# EAGLE design EAGLE (EAGLE 9.6.2)
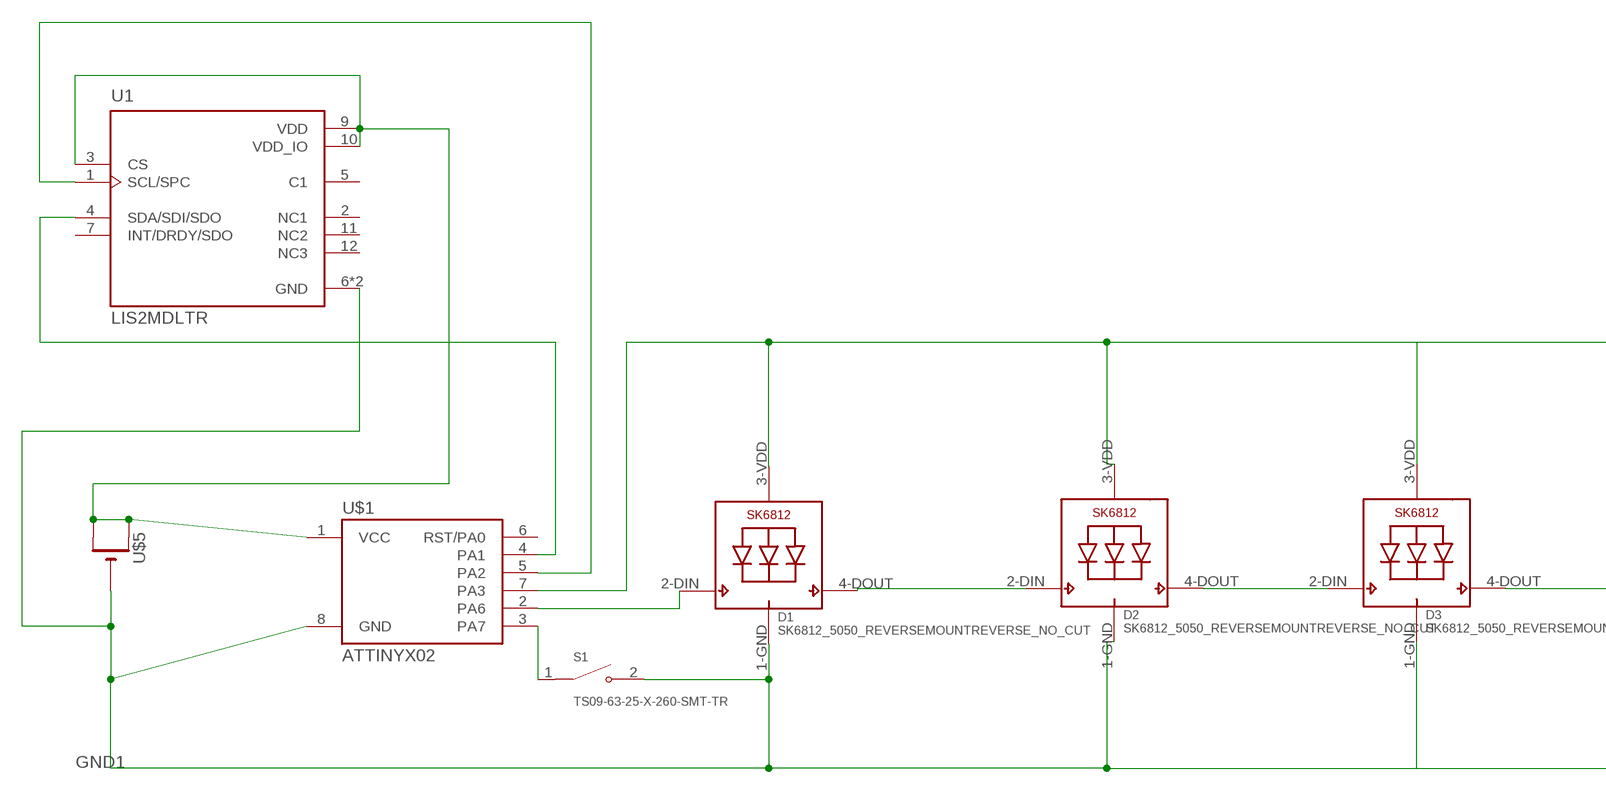
[diagram p0: schematic, sheet 1, part 1 of 2]
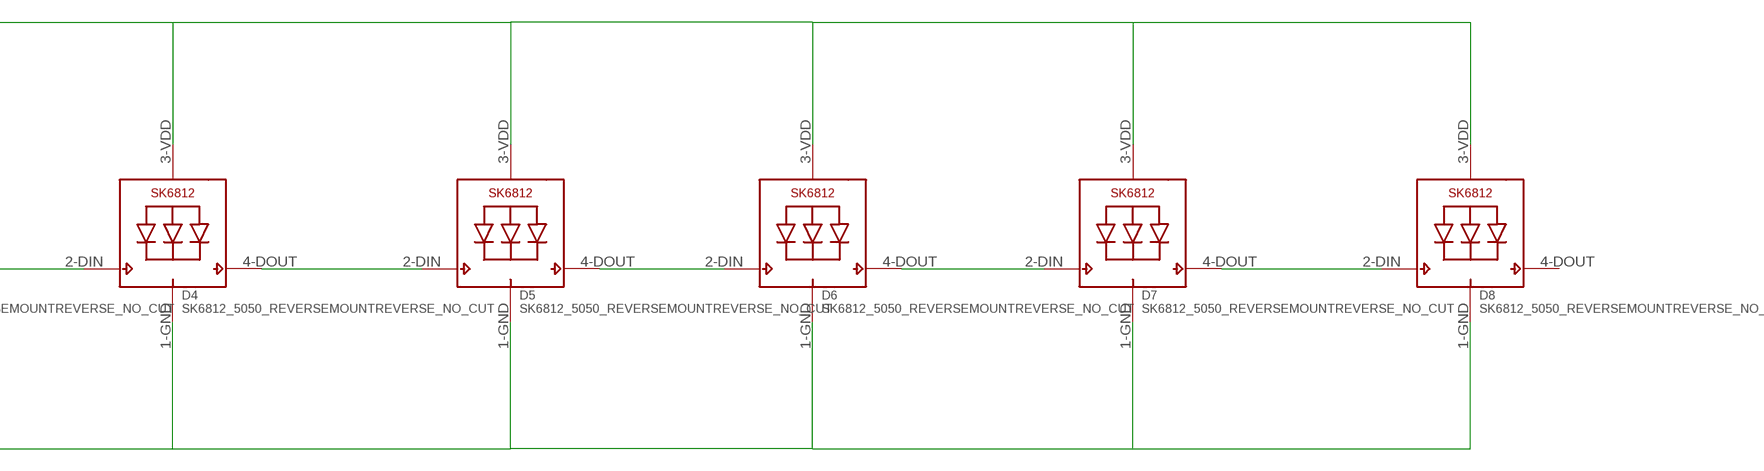
[diagram p1: schematic, sheet 1, part 2 of 2]

## Parts
D1  SK6812_5050_REVERSEMOUNTREVERSE_NO_CUT  [SK6812_REVERSE_NO_CUT]
D2  SK6812_5050_REVERSEMOUNTREVERSE_NO_CUT  [SK6812_REVERSE_NO_CUT]
D3  SK6812_5050_REVERSEMOUNTREVERSE_NO_CUT  [SK6812_REVERSE_NO_CUT]
D4  SK6812_5050_REVERSEMOUNTREVERSE_NO_CUT  [SK6812_REVERSE_NO_CUT]
D5  SK6812_5050_REVERSEMOUNTREVERSE_NO_CUT  [SK6812_REVERSE_NO_CUT]
D6  SK6812_5050_REVERSEMOUNTREVERSE_NO_CUT  [SK6812_REVERSE_NO_CUT]
D7  SK6812_5050_REVERSEMOUNTREVERSE_NO_CUT  [SK6812_REVERSE_NO_CUT]
D8  SK6812_5050_REVERSEMOUNTREVERSE_NO_CUT  [SK6812_REVERSE_NO_CUT]
S1  TS09-63-25-X-260-SMT-TR  [SW_TS09-63-25-X-260-SMT-TR]
U1  LIS2MDLTR  [PQFN50P200X200X70-12N]
U$1  ATTINYX02  [SOIC08_JEDEC_150MIL]
U$5  CR2032SMT  [CR2032-SMD]

## Nets
GND1: D1.1-GND(GND) D2.1-GND(GND) D3.1-GND(GND) D4.1-GND(GND) D5.1-GND(GND) D6.1-GND(GND) D7.1-GND(GND) D8.1-GND(GND) S1.2 U1.6(GND) U1.8(GND) U$1.8(GND) U$5.-
N$2: D1.4-DOUT(DO) D2.2-DIN(DI)
N$3: D1.2-DIN(DI) U$1.2(PA6)
N$5: D3.4-DOUT(DO) D4.2-DIN(DI)
N$6: D2.4-DOUT(DO) D3.2-DIN(DI)
N$7: S1.1 U$1.3(PA7)
N$8: D4.4-DOUT(DO) D5.2-DIN(DI)
N$88: D6.4-DOUT(DO) D7.2-DIN(DI)
N$89: D7.4-DOUT(DO) D8.2-DIN(DI)
N$90: D5.4-DOUT(DO) D6.2-DIN(DI)
N$91: U1.1(SCL/SPC) U$1.5(PA2)
N$92: U1.4(SDA/SDI/SDO) U$1.4(PA1)
VCC1: U1.3(CS) U1.9(VDD) U1.10(VDD_IO) U$1.1(VCC) U$5.+$1(+) U$5.+$2(+1)
VDD2: D1.3-VDD(VDD) D2.3-VDD(VDD) D3.3-VDD(VDD) D4.3-VDD(VDD) D5.3-VDD(VDD) D6.3-VDD(VDD) D7.3-VDD(VDD) D8.3-VDD(VDD) U$1.7(PA3)
Unconnected: D8.4-DOUT(DO) U1.2(NC1) U1.5(C1) U1.7(INT/DRDY/SDO) U1.11(NC2) U1.12(NC3) U$1.6(RST/PA0)

## Library data of the parts
D1-D8 = mylibrary:SK6812_5050_REVERSEMOUNT
S1 = mylibrary:TS09-63-25-X-260-SMT-TR; MANUFACTURER: CUI Devices; MAXIMUM_PACKAGE_HEIGHT: 2.5 mm; PARTREV: 1.0; STANDARD: Manufacturer Recommendations
U1 = 2025:LIS2MDLTR: Check availability; AVAILABILITY: In Stock; CHECK_PRICES: https://www.snapeda.com/parts/LIS2MDLTR/STMicroelectronics/view-part/?ref=eda; DESCRIPTION: Magnetoresistive Sensor X, Y, Z Axis 12-LGA (2x2); MF: STMicroelectronics; MP: LIS2MDLTR; PACKAGE: WFLGA-12 STMicroelectronics; PRICE: None; SNAPEDA_LINK: https://www.snapeda.com/parts/LIS2MDLTR/STMicroelectronics/view-part/?ref=snap
U$1 = mylibrary:ATTINYX02
U$5 = adafruit:CR2032

## Board
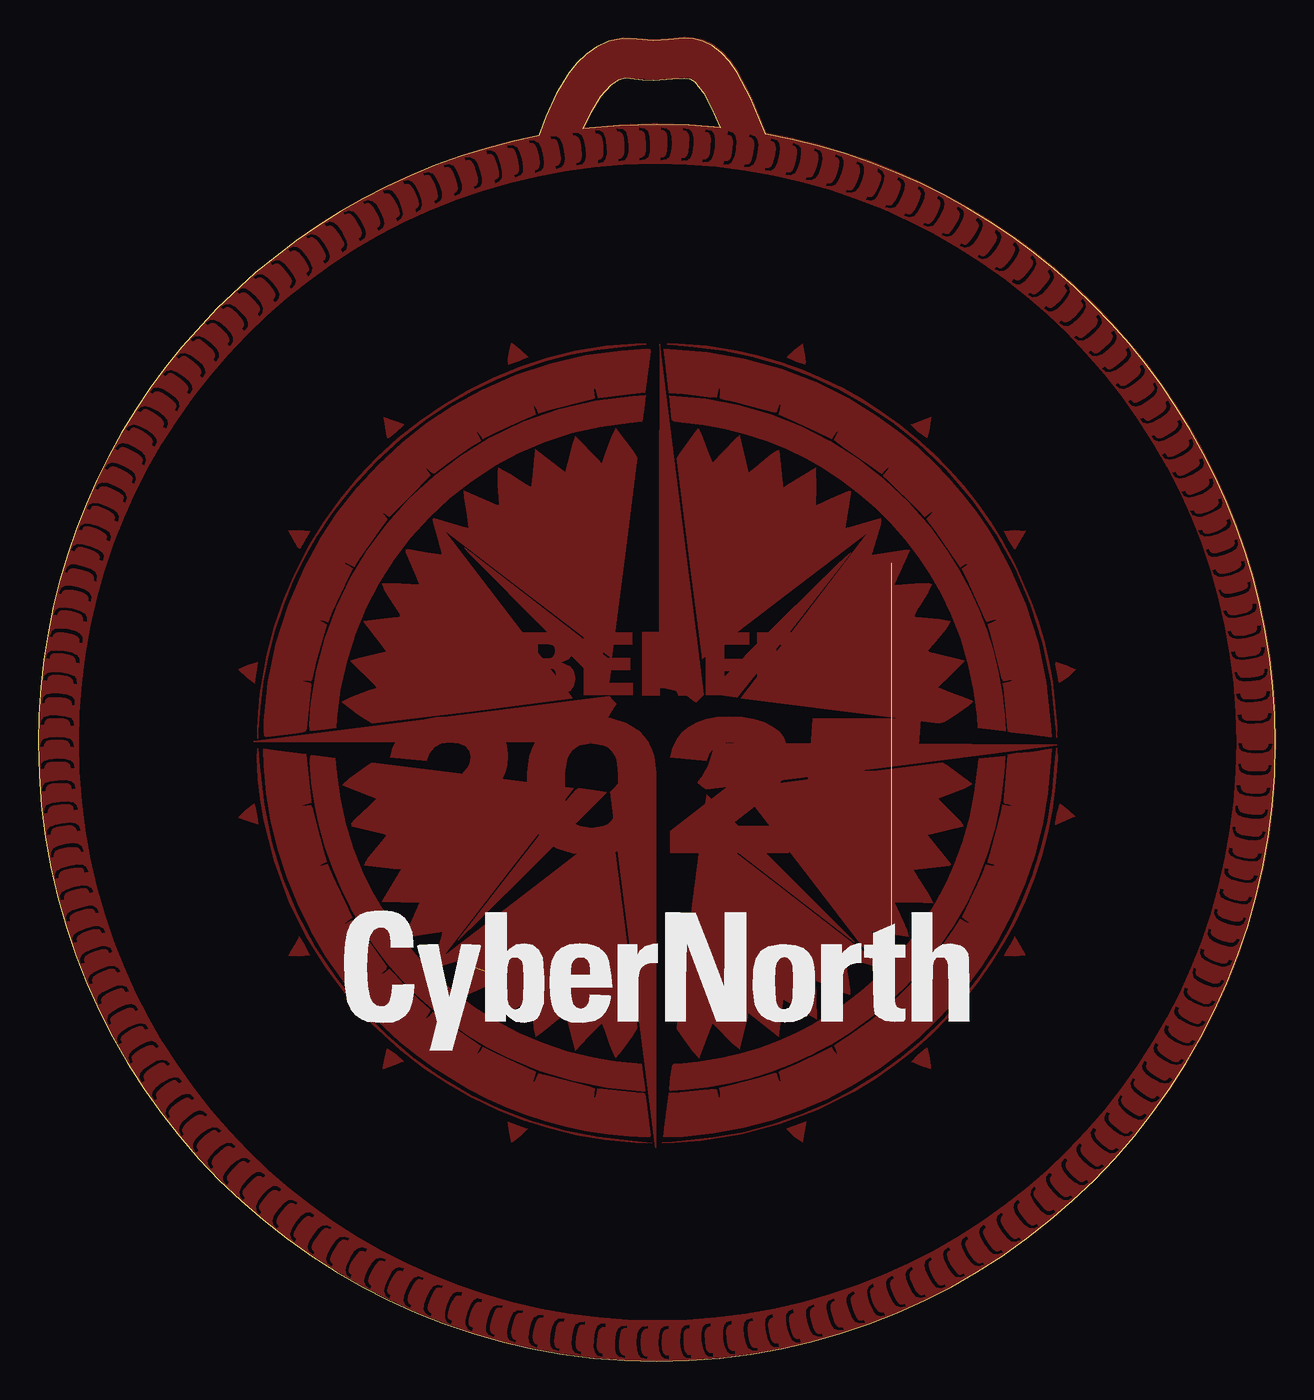
[diagram p2: board, top side]
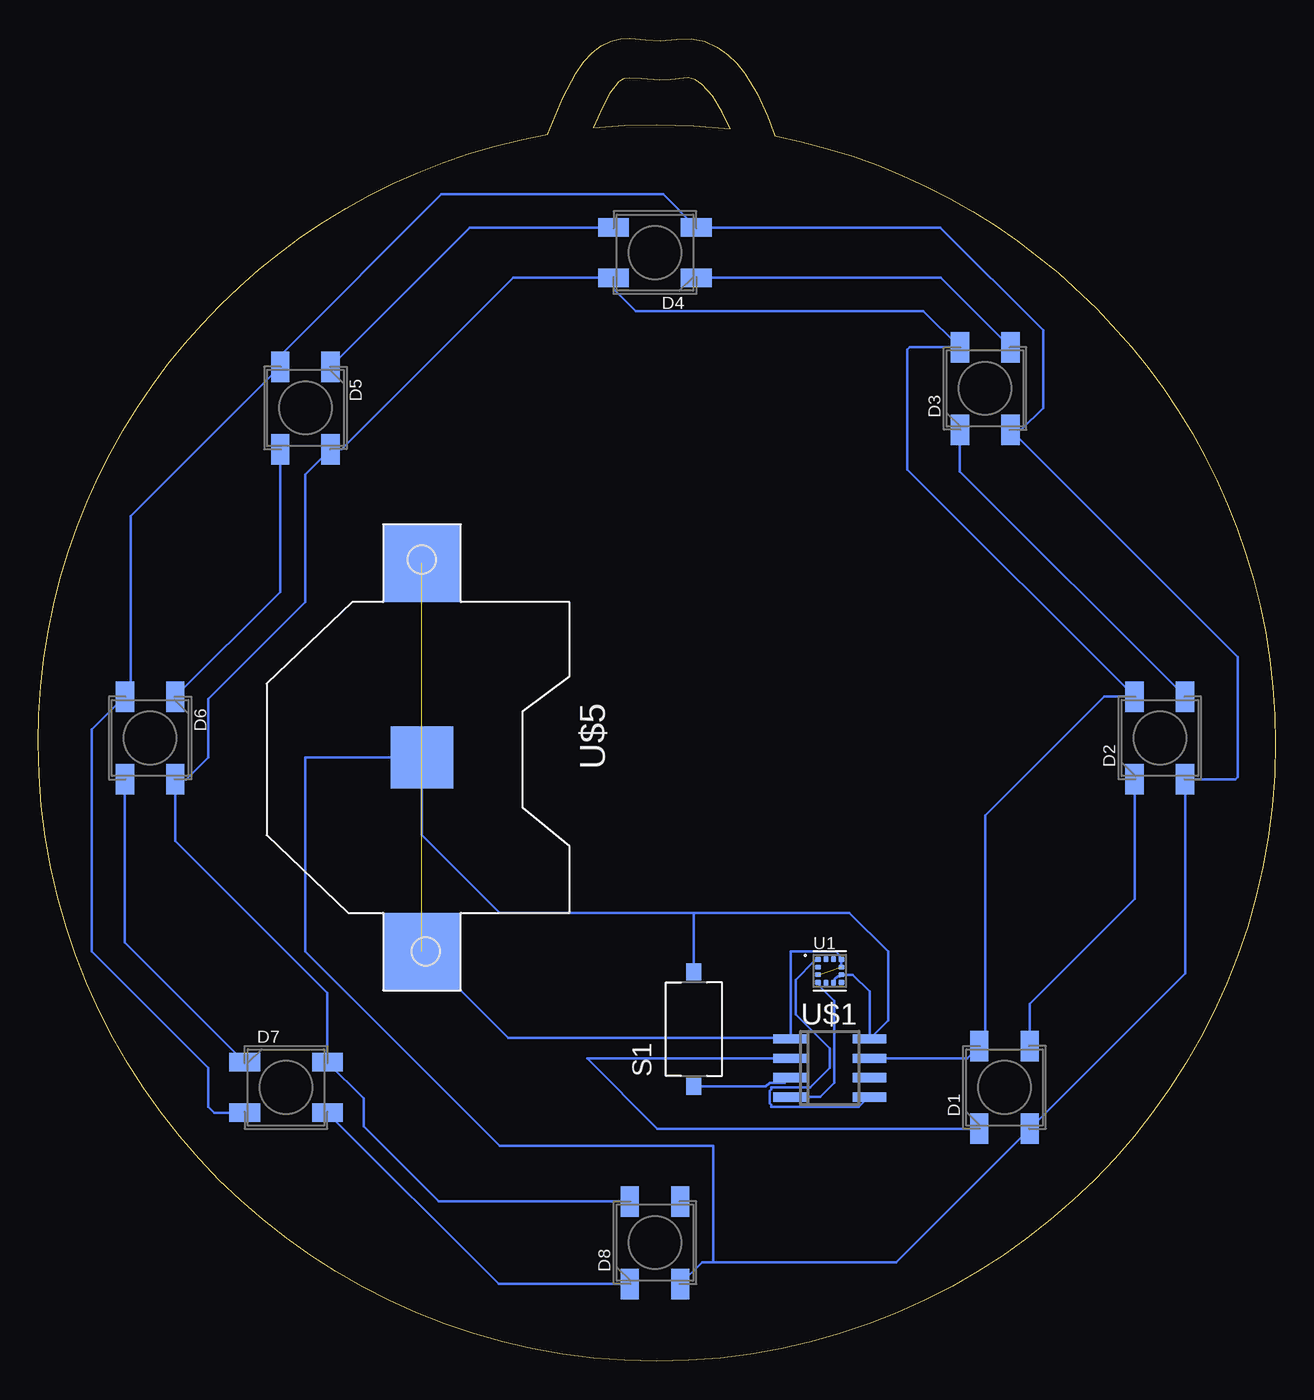
[diagram p3: board, bottom side, seen from below]

Size 80.91 x 86.56 mm. Coordinates in mm from the lower left corner, seen from the top.
Outline: 164 segments
Copper layers (1*16): Top 0.035mm / dielectric 1.5mm / Bottom 0.035mm
Design rules "default *": minimum track width 6mil, minimum drill 0.35mm, track to track 6mil, track to pad 6mil, pad to pad 6mil, via to via 6mil, smd to smd 6mil, copper to edge 0mil, drill to drill 6mil, minimum pad ring 10mil, minimum via ring 8mil, stop-mask expansion 4mil, vias tented up to drill 0mil, thermal gap 10mil
tRestrict: area 30.7,77.5 to 31.7,79.5; area 32.1,77.8 to 33,79.9; area 29.3,77.1 to 30.3,79.2; area 27.9,76.7 to 29,78.8; area 26.6,76.3 to 27.7,78.3; area 33.6,78 to 34.4,80.1; area 35,78.2 to 35.8,80.3; area 36.4,78.4 to 37.2,80.5; area 37.9,78.5 to 38.6,80.6; area 39.3,78.6 to 40,80.7; area 40.7,78.6 to 41.4,80.7; area 42.1,78.6 to 42.8,80.7; 162 more areas
bRestrict: area 5.8,39 to 9.3,42.6; area 17.2,61.8 to 20.8,65.4; area 38.8,70.7 to 42.4,74.3; area 61.6,60.6 to 65.2,64.2; area 71.8,39 to 75.4,42.6; area 62.9,16.1 to 66.5,19.7; area 38.8,6 to 42.4,9.6; area 15.9,16.1 to 19.5,19.7

### Footprints (pad centres in the part's own frame; a part is rotated, then mirrored left to right if it is on the bottom)
SK6812_REVERSE_NO_CUT = smd 2 x 1.2: 1-GND -2.7,-1.65; 2-DIN -2.7,1.65; 3-VDD 2.7,1.65; 4-DOUT 2.7,-1.65
SW_TS09-63-25-X-260-SMT-TR = smd 1.1 x 1: 1 -3.75,0; 2 3.75,0
PQFN50P200X200X70-12N = smd 0.41 x 0.35: 1 -0.76,0.75; 2 -0.76,0.25; 3 -0.76,-0.25; 4 -0.76,-0.75; 7 0.76,-0.75; 8 0.76,-0.25; 9 0.76,0.25; 10 0.76,0.75 | smd 0.35 x 0.41: 5 -0.25,-0.76; 6 0.25,-0.76; 11 0.25,0.76; 12 -0.25,0.76
SOIC08_JEDEC_150MIL = smd 0.6 x 2.2: 1 -1.905,-2.6; 2 -0.635,-2.6; 3 0.635,-2.6; 4 1.905,-2.6; 5 1.905,2.6; 6 0.635,2.6; 7 -0.635,2.6; 8 -1.905,2.6
CR2032-SMD = smd 5.08 x 5.08: +$1 -12.7,0; +$2 12.7,0 | smd 4.064 x 4.064: - 0,0

### Placement (x,y rotation side)
D1  17.71,17.92 90 bottom
D2  7.55,40.78 90 bottom
D3  18.98,63.64 90 bottom
D4  40.57,72.53 180 bottom
D5  63.43,62.37 270 bottom
D6  73.59,40.78 270 bottom
D7  64.7,17.92 0 bottom
D8  40.57,7.76 90 bottom
S1  38.03,21.73 90 bottom
U1  29.14,25.54 0 bottom
U$1  29.14,19.19 270 bottom
U$5  55.81,39.51 270 bottom

### Tracks (layer width: path | path; a pad name or v marks a point on that pad's centre or on a via)
GND1
  Bottom 0.152: D7.1-GND 69.4,16.27 69.78,16.65 69.78,19.19 77.4,26.81 77.4,41.32 D6.1-GND 74.86,43.86 74.86,55.29 D5.1-GND 65.08,65.8 54.54,76.34 40.03,76.34 D4.1-GND 21.9,74.18 15.17,67.45 15.17,62.37 16.6,60.94 D3.1-GND 2.47,46.08 2.47,38.24 2.63,38.08 D2.1-GND 5.9,25.38 D1.1-GND 24.79,6.49 36.76,6.49 | D8.1-GND 37.49,6.49 36.76,6.49 | 36.76,6.49 36.76,14.11 50.73,14.11 63.43,26.81 63.43,39.51 U$5.- 55.81,34.43 50.73,29.35 38.03,29.35 | U1.6 28.82,24.86 28.82,25.01 28.63,25.19 28.48,25.19 U1.8 27.62,25.29 26.54,24.21 U$1.8 25.33,22.3 25.33,26.81 27.87,29.35 38.03,29.35 | 38.03,29.35 S1.2
N$1
  pour Top: 13.57,36.05 13.12,35.59 13.76,35.33 14.38,35.14 14.33,35.63 14.2,36.32 14.13,36.47
N$2
  Bottom 0.152: D1.4-DOUT 16.06,23.38 9.2,30.24 D2.2-DIN
N$3
  Bottom 0.152: D1.2-DIN 40.41,15.22 45.02,19.82 U$1.2
N$4
  pour Top: 13.71,45.52 13.11,45.25 13.63,44.78 14.16,44.38 14.37,45.72
N$5
  Bottom 0.152: D3.4-DOUT 21.87,70.88 D4.2-DIN
N$6
  Bottom 0.152: D2.4-DOUT 20.63,58.21 D3.2-DIN
N$7
  Bottom 0.152: U$1.3 32.07,18.22 33.08,18.22 33.32,17.98 S1.1
N$8
  Bottom 0.152: D4.4-DOUT 52.67,74.18 D5.2-DIN
N$9
  pour Top: 17.02,53.23 16.38,54.34 17.07,54.38 17.76,54.31 17.11,53.16
N$10
  pour Top: 23.91,61.28 22.6,61.74 22.8,60.5 22.83,60.43 22.91,60.44 23.38,60.8
N$11
  pour Top: 30.75,65.55 30.75,65.55 30.88,66.24 30.96,66.61 31.48,66.18 32.01,65.7 31.44,65.44 30.77,65.22
N$12
  pour Top: 49.47,66.17 48.97,65.7 49.54,65.43 49.54,65.43 50.18,65.22 50.21,65.38 50.14,65.87 49.99,66.55
N$13
  pour Top: 57.56,60.81 57.09,61.26 57.74,61.56 58.38,61.79 58.34,61.56 58.23,60.88 58.09,60.42 57.56,60.81
N$14
  pour Top: 63.51,53.7 63.18,54.32 63.85,54.38 64.54,54.32 63.86,53.14
N$15
  pour Top: 66.67,44.98 66.56,45.61 66.59,45.73 67.26,45.52 67.84,45.26 67.32,44.78 66.78,44.41
N$16
  pour Top: 67.8,35.63 66.54,35.1 66.55,35.26 66.55,35.26 66.68,35.94 66.82,36.47 67.35,36.08
N$17
  pour Top: 63.17,26.56 63.17,26.56 63.86,26.53 64.54,26.58 64.21,27.2 63.87,27.78 63.52,27.18
N$18
  pour Top: 57.72,19.33 57.11,19.59 57.55,20.06 58.1,20.49 58.23,20.03 58.34,19.34 58.32,19.12 57.72,19.33
N$19
  pour Top: 50.24,15.68 48.95,15.2 49.44,14.73 49.99,14.35
N$20
  pour Top: 30.82,14.97 30.74,15.65 31.98,15.21 31.53,14.75 30.97,14.31
N$21
  pour Top: 28.39,47.68 27.16,47.68 28.54,44.8 28.54,43.58 29.67,43.58 29.67,44.8 31.04,47.68 29.81,47.68 29.11,45.83 29.09,45.83
N$22
  pour Top: 23.02,34.67 23.02,33.3 30.78,33.3 30.78,34.99 26.82,34.99 28.96,36.67 30,37.64 30.33,38.08 30.55,38.54 30.67,39.03 30.71,39.57 30.71,39.73 30.65,40.28 30.46,40.76 30.15,41.17 29.71,41.51 29.15,41.79 28.49,41.99 27.72,42.11 26.84,42.15 26.06,42.11 25.37,41.98 24.76,41.77 24.23,41.48 23.79,41.11 23.44,40.66 23.19,40.14 23.03,39.55 25.4,39.3 25.6,39.83 25.92,40.22 26.37,40.45 26.93,40.53 27.51,40.47 27.92,40.28 28.19,39.99 28.27,39.58 28.27,39.52 28.22,39.12 28.04,38.75 27.68,38.34 27.1,37.83
N$23
  pour Top: 31.98,38.49 31.98,36.82 32.11,35.75 32.26,35.27 32.48,34.84 32.76,34.45 33.09,34.12 33.93,33.58 34.96,33.27 36.19,33.16 37.43,33.27 38.47,33.58 39.3,34.12 39.64,34.45 39.91,34.84 40.13,35.27 40.29,35.75 40.41,36.82 40.41,38.49 40.29,39.56 40.13,40.04 39.91,40.47 39.64,40.85 39.3,41.19 38.47,41.71 37.43,42.04 36.19,42.15 36.17,42.15 36.17,40.45 36.19,40.45 36.96,40.33 37.26,40.17 37.51,39.96 37.7,39.67 37.84,39.33 37.95,38.43 37.95,36.88 37.84,35.99 37.7,35.64 37.51,35.35 37.26,35.13 36.96,34.98 36.19,34.85 35.43,34.98 35.13,35.13 34.88,35.35 34.69,35.64 34.56,35.99 34.45,36.88 34.45,38.43 34.56,39.32 34.69,39.66 34.88,39.94 35.12,40.16 35.4,40.31 36.11,40.45 36.11,42.15 34.93,42.03 33.93,41.71 33.09,41.19 32.76,40.85 32.48,40.47 32.26,40.04 32.11,39.56
N$24
  pour Top: 41.33,34.67 41.33,33.3 49.09,33.3 49.09,34.99 45.14,34.99 47.27,36.67 48.32,37.64 48.65,38.08 48.86,38.54 48.99,39.03 49.03,39.57 49.03,39.73 48.96,40.28 48.77,40.76 48.46,41.17 48.02,41.51 47.46,41.79 46.8,41.99 46.03,42.11 45.15,42.15 44.37,42.11 43.68,41.98 43.07,41.77 42.54,41.48 42.1,41.11 41.76,40.66 41.5,40.14 41.34,39.55 43.71,39.3 43.92,39.83 44.23,40.22 44.68,40.45 45.24,40.53 45.82,40.47 46.24,40.28 46.5,39.99 46.59,39.58 46.59,39.52 46.54,39.12 46.35,38.75 45.99,38.34 45.42,37.83
N$25
  pour Top: 52.44,36 50.06,35.76 50.22,35.17 50.48,34.65 50.83,34.2 51.27,33.83 51.81,33.54 52.45,33.33 53.2,33.2 54.04,33.16 54.98,33.2 55.8,33.33 56.5,33.54 57.08,33.83 57.54,34.21 57.86,34.65 58.06,35.18 58.13,35.77 58.13,36.01 58,36.78 57.85,37.15 57.62,37.49 57.29,37.81 56.87,38.08 56.34,38.31 55.69,38.48 54.91,38.59 53.99,38.62 52.72,38.62 52.85,40.31 57.59,40.31 57.7,42.01 50.66,42.01 50.31,37.13 53.99,37.13 54.72,37.06 55.24,36.84 55.56,36.5 55.66,36.01 55.66,35.8 55.62,35.51 55.51,35.25 55.32,35.04 55.03,34.87 54.61,34.76 54.04,34.73 53.41,34.81 52.95,35.06 52.63,35.47
N$26
  pour Top: 23.3,44.74 23.24,45.24 23.24,46.04 23.3,46.54 23.47,46.96 23.74,47.3 24.1,47.54 24.57,47.7 25.11,47.75 25.89,47.66 26.46,47.38 26.84,46.93 27.05,46.34 25.92,46.23 25.83,46.55 25.68,46.78 25.47,46.91 25.17,46.95 24.85,46.89 24.6,46.72 24.45,46.43 24.4,46.02 24.4,45.27 24.45,44.85 24.6,44.55 24.84,44.37 25.17,44.31 25.47,44.36 25.69,44.5 25.84,44.74 25.93,45.08 27.05,44.97 26.86,44.36 26.47,43.9 25.89,43.61 25.11,43.52 24.56,43.57 24.1,43.72 23.73,43.97 23.46,44.31
N$27
  pour Top: 33.77,43.58 31.47,43.58 31.47,47.68 33.2,47.68 33.2,46.93 32.64,46.93 32.64,45.98 33.2,45.98 33.2,45.33 32.64,45.33 32.64,44.34 33.39,44.34 33.69,44.38 33.86,44.54 33.92,44.81 33.92,44.87 33.89,45.07 33.8,45.21 33.65,45.3 33.43,45.33 33.23,45.33 33.23,45.98 33.39,45.98 33.63,46.03 33.79,46.2 33.85,46.44 33.85,46.49 33.81,46.69 33.72,46.82 33.31,46.93 33.23,46.93 33.23,47.68 33.65,47.68 34.38,47.57 34.63,47.44 34.82,47.25 34.93,47.01 34.97,46.71 34.97,46.68 34.88,46.25 34.62,45.92 34.2,45.7 34.74,45.48 34.99,45.15 35.08,44.69 35.08,44.66 35,44.19 34.75,43.85 34.34,43.65
N$28
  pour Top: 38.84,43.58 35.72,43.58 35.72,47.68 38.81,47.68 38.81,46.89 36.89,46.89 36.89,46.02 38.69,46.02 38.69,45.23 36.89,45.23 36.89,44.38 38.84,44.38
N$29
  pour Top: 39.49,47.68 39.49,43.58 40.66,43.58 40.66,44.89 41.3,44.89 41.86,43.58 43.05,43.58 42.38,45.06 42.6,45.21 42.88,45.59 42.97,46.11 42.97,46.44 42.88,46.98 42.6,47.37 42.15,47.61 41.53,47.68 40.93,47.68 40.93,46.89 41.19,46.89 41.48,46.86 41.69,46.76 41.81,46.58 41.85,46.33 41.85,46.23 41.81,45.99 41.69,45.82 41.48,45.72 41.19,45.69 40.66,45.69 40.66,46.89 40.89,46.89 40.89,47.68
N$30
  pour Top: 44.84,43.58 43.67,43.58 43.67,47.68 46.47,47.68 46.47,46.89 44.84,46.89 44.84,45.95 46.36,45.95 46.36,45.16 44.84,45.16
N$31
  pour Top: 50.17,43.58 47.05,43.58 47.05,47.68 50.14,47.68 50.14,46.89 48.22,46.89 48.22,46.02 50.03,46.02 50.03,45.23 48.22,45.23 48.22,44.38 50.17,44.38
N$32
  pour Top: 51.73,44.93 50.57,44.88 50.74,44.28 51.1,43.86 51.66,43.62 52.44,43.54 53.24,43.62 53.84,43.86 54.21,44.25 54.34,44.77 54.31,45.08 54.2,45.33 53.86,45.68 53.38,45.89 52.87,46.02 52.4,46.13 52.05,46.3 51.95,46.41 51.92,46.57 51.96,46.74 52.07,46.88 52.49,46.99 52.79,46.96 53,46.85 53.14,46.68 53.2,46.43 54.37,46.51 54.22,47.05 53.85,47.44 53.29,47.67 52.52,47.75 51.73,47.67 51.14,47.43 50.77,47.06 50.65,46.55 50.68,46.23 50.78,45.97 51.13,45.61 51.6,45.39 52.11,45.26 52.59,45.15 52.93,45 53.03,44.88 53.07,44.73 53.03,44.55 52.91,44.41 52.73,44.32 52.48,44.29 52.19,44.33 51.96,44.46 51.81,44.66
N$33
  pour Top: 54.6,47.68 54.6,46.89 55.67,46.89 55.67,43.58 56.84,43.58 56.84,46.89 57.9,46.89 57.9,47.68
N$34
  pour Top: 22.64,19.14 22.56,19.14 22.57,19.2 22.7,19.84 22.84,20.45 23.37,20.09 23.87,19.62 23.35,19.38
N$35
  pour Top: 16.74,27.18 16.38,26.55 17.07,26.53 17.75,26.58 17.42,27.2 17.09,27.78
N$36
  pour Top: 14.37,42.41 14.33,41.4 14.34,40.76 14.4,41.31 14.53,42.81 14.53,42.81 14.72,44.46 15.04,46.12 15.47,47.77 16.01,49.4 16.66,51 17.41,52.55 18.26,54.05 19.21,55.49 20.54,57.19 22.07,58.85 23.72,60.38 25.43,61.71 26.87,62.66 28.38,63.51 29.94,64.27 31.55,64.92 33.18,65.46 34.84,65.89 36.5,66.2 38.15,66.39 39.73,66.53 39.78,66.55 39.68,66.56 39.06,66.55 37.16,66.41 35.16,66.08 33.31,65.62 31.52,65.04 29.78,64.34 28.11,63.51 26.51,62.57 24.98,61.52 23.53,60.37 22.16,59.12 20.89,57.78 19.71,56.35 18.63,54.84 17.66,53.25 16.8,51.6 16.06,49.87 15.44,48.09 14.95,46.25 14.5,43.66
N$37
  pour Top: 41.25,66.56 41.14,66.56 41.19,66.54 42.85,66.39 44.82,66.14 46.76,65.74 48.69,65.18 50.57,64.46 52.4,63.6 54.17,62.6 55.85,61.47 57.44,60.2 59.38,58.36 61.11,56.34 62.61,54.18 63.88,51.89 64.92,49.48 65.71,46.97 66.24,44.38 66.51,41.72 66.62,40.79 66.64,41.53 66.64,41.53 66.33,44.47 66.09,45.84 65.78,47.16 65.4,48.45 64.95,49.71 63.82,52.25 63.1,53.57 62.32,54.84 61.47,56.05 60.56,57.21 59.58,58.31 58.55,59.36 57.47,60.34 56.33,61.26 55.15,62.11 53.91,62.9 52.63,63.62 51.31,64.27 49.96,64.84 48.56,65.34 47.13,65.76 45.67,66.1 43.73,66.41 41.87,66.56
N$38
  pour Top: 14.4,38.12 14.33,39.43 14.35,40.1 14.46,38.91 14.74,36.39 15.24,33.94 15.97,31.58 16.91,29.31 18.06,27.15 19.42,25.1 20.99,23.16 22.76,21.35 24.46,19.9 26.27,18.6 28.18,17.47 30.18,16.5 32.25,15.71 34.39,15.1 36.59,14.68 38.83,14.44 40.12,14.3 39.82,14.26 39.06,14.29 37.05,14.48 35.23,14.8 33.45,15.23 31.72,15.77 30.03,16.44 28.39,17.23 26.8,18.14 25.25,19.17 23.74,20.32 21.89,22.05 20.13,23.99 18.8,25.8 17.62,27.67 17,28.86 16.43,30.1 15.48,32.7 14.79,35.4 14.56,36.76
N$39
  pour Top: 41.6,14.28 40.81,14.29 42.09,14.44 44.14,14.64 46.09,14.99 48,15.48 49.89,16.14 51.65,16.9 53.34,17.78 54.94,18.77 56.46,19.87 57.89,21.07 59.23,22.37 60.47,23.75 61.61,25.21 62.64,26.75 63.56,28.36 64.37,30.04 65.05,31.77 65.61,33.55 66.05,35.38 66.35,37.24 66.51,39.14 66.62,40.11 66.64,39.38 66.49,37.58 66.28,36.04 65.98,34.53 65.59,33.04 65.11,31.57 64.54,30.14 63.89,28.75 63.15,27.39 62.34,26.08 61.46,24.82 60.49,23.61 59.46,22.45 58.36,21.35 57.2,20.32 55.97,19.35 54.68,18.46 53.33,17.64 50.98,16.46 48.53,15.53 45.97,14.85 43.34,14.43
N$40
  pour Top: 40.9,14.87 40.88,14.73 40.99,14.67 42.18,14.73 42.18,14.73 44.16,14.94 46.1,15.29 48,15.79 49.84,16.43 51.63,17.22 53.37,18.14 55.04,19.2 56.65,20.39 57.62,21.23 58.68,22.24 59.68,23.29 60.52,24.26 61.75,25.92 62.83,27.64 63.77,29.42 64.56,31.26 65.2,33.16 65.69,35.13 66.03,37.15 66.23,39.24 66.27,40.04 65.87,40 65.35,39.89 64.87,39.83 63.95,39.76 63.4,39.68 63.35,38.95 63.2,37.41 63.15,36.61 63.25,36.49 63.46,36.47 63.67,36.41 63.7,36.3 63.36,36.33 63.05,36.38 62.97,35.97 62.25,33.25 62.08,32.73 62.09,32.65 62.13,32.63 62.44,32.53 62.63,32.43 62.65,32.36 62.31,32.4 61.98,32.48 61.7,31.79 60.93,30.11 60.43,29.06 60.71,28.85 60.9,28.73 60.92,28.64 60.8,28.63 60.58,28.75 60.3,28.92 59.84,28.19 58.73,26.61 58.1,25.77 58.35,25.53 58.55,25.26 58.25,25.42 57.99,25.63 57.32,24.92 55.96,23.56 55.28,22.92 55.49,22.66 55.66,22.36 55.38,22.56 55.14,22.82 54.44,22.28 52.91,21.21 52.06,20.64 52.18,20.33 52.28,20 52.06,20.23 51.88,20.54 51.31,20.24 49.85,19.53 48.61,19.01 48.43,18.91 48.52,18.58 48.56,18.26 48.49,18.29 48.39,18.47 48.28,18.79 48.16,18.82 47.12,18.51 45.36,18.04 44.53,17.86 44.59,17.55 44.61,17.2 44.51,17.27 44.44,17.5 44.42,17.69 44.3,17.77 43.51,17.72 41.96,17.56 41.23,17.52 41.17,17 40.94,15.28
N$41
  pour Top: 41.32,17.7 41.29,17.82 41.36,18.57 41.49,19.37 41.61,19.45 41.82,19.46 43.09,19.58 44.68,19.84 45.95,20.13 47.19,20.51 48.39,20.96 49.57,21.48 50.71,22.07 51.8,22.73 52.86,23.46 53.87,24.25 54.83,25.1 55.74,26 56.6,26.96 57.39,27.98 58.13,29.04 58.8,30.15 59.41,31.3 59.95,32.5 60.5,34.02 60.94,35.61 61.26,37.19 61.43,38.69 61.55,39.45 63.21,39.61 63.15,38.49 62.93,36.69 62.56,34.94 62.07,33.25 61.46,31.61 60.72,30.03 59.86,28.51 58.88,27.06 57.77,25.68 56.55,24.36 54.86,22.81 53.05,21.49 51.81,20.72 50.55,20.03 49.27,19.44 47.95,18.94 46.6,18.52 45.21,18.18 43.77,17.92 42.28,17.74 41.41,17.68
N$42
  pour Top: 43.76,66 40.89,66.22 41.25,63.38 42.25,63.29 43.79,63.13 44.34,63.09 44.42,63.18 44.44,63.37 44.51,63.63 44.62,63.69 44.59,63.33 44.56,63.06 44.67,62.99 45.57,62.79 47.15,62.37 48.16,62.09 48.29,62.14 48.35,62.31 48.47,62.63 48.57,62.63 48.51,62.28 48.43,61.97 49.24,61.62 50.95,60.82 51.88,60.36 52.05,60.64 52.27,60.9 52.32,60.83 52.19,60.59 52.06,60.31 52.79,59.76 54.35,58.67 55.16,58.06 55.39,58.33 55.57,58.51 55.66,58.54 55.5,58.22 55.28,57.95 55.61,57.66 57.54,55.72 57.98,55.27 58.29,55.49 58.47,55.62 58.56,55.62 58.34,55.32 58.1,55.1 58.65,54.38 60.2,52.13 60.3,51.97 60.6,52.14 60.94,52.26 60.68,52.02 60.38,51.84 60.88,50.86 61.94,48.51 62.02,48.38 62.24,48.45 62.59,48.55 62.68,48.53 62.68,48.48 62.41,48.34 62.11,48.2 62.32,47.42 63,44.75 63.07,44.53 63.26,44.53 63.6,44.61 63.69,44.61 63.72,44.55 63.64,44.46 63.4,44.4 63.08,44.35 63.13,44.03 63.38,41.54 63.41,41.24 63.6,41.18 64.85,41.02 66.04,40.87 66.28,40.86 66.23,41.64 65.94,44.4 65.4,47.02 64.59,49.53 63.51,51.98 62.85,53.21 62.12,54.41 61.33,55.56 60.48,56.67 59.56,57.74 58.58,58.76 57.54,59.73 56.44,60.67 54.8,61.84 53.04,62.95 50.87,64.03 48.55,64.91 46.15,65.58
N$43
  pour Top: 41.46,61.57 41.29,63.18 43.65,62.98 45.8,62.57 47.88,61.97 49.87,61.18 51.77,60.2 53.58,59.05 55.28,57.72 56.87,56.22 58.34,54.55 59.46,52.97 60.21,51.76 60.89,50.5 61.48,49.21 61.99,47.88 62.41,46.52 62.75,45.14 63,43.72 63.17,42.28 63.24,41.31 63.23,41.24 63.14,41.22 62.28,41.33 61.49,41.45 61.44,42.17 61.23,43.85 60.87,45.57 60.36,47.27 59.71,48.92 59.09,50.22 58.38,51.46 57.59,52.65 56.73,53.77 55.79,54.83 54.8,55.82 53.74,56.74 52.62,57.59 51.45,58.37 50.23,59.06 48.96,59.67 47.65,60.2 46.31,60.64 44.93,60.99 43.53,61.25 42.09,61.41 41.61,61.47
N$44
  pour Top: 17.78,41.28 17.76,41.67 17.86,43.02 18.22,45.18 18.77,47.28 19.51,49.3 20.45,51.24 21.56,53.08 22.85,54.82 24.3,56.44 25.92,57.93 27.69,59.24 29.56,60.42 31.73,61.46 34.06,62.28 36.46,62.85 38.87,63.15 39.68,63.2 39.59,62.33 39.48,61.47 38.62,61.39 36.73,61.13 34.89,60.71 33.13,60.14 31.43,59.42 29.81,58.56 28.29,57.56 26.85,56.44 25.52,55.21 24.31,53.86 23.2,52.41 22.23,50.87 21.39,49.24 20.69,47.54 20.13,45.76 19.74,43.92 19.5,42.02 19.46,41.43 18.73,41.35 17.88,41.23
N$45
  pour Top: 14.76,41.88 14.73,41.24 14.77,40.94 14.92,40.87 15.24,40.91 15.24,40.91 16.83,41.1 17.26,41.16 17.47,41.24 17.55,41.41 17.58,41.74 17.87,44.24 17.83,44.34 17.55,44.4 17.3,44.46 17.23,44.53 17.37,44.58 17.74,44.53 17.83,44.52 17.91,44.63 18.2,45.8 18.87,48.18 18.6,48.32 18.3,48.48 18.38,48.54 18.69,48.45 18.96,48.36 19.23,49.05 20.03,50.8 20.56,51.84 20.34,51.98 20.07,52.11 20.02,52.22 20.08,52.28 20.34,52.15 20.67,51.99 21.04,52.58 22.46,54.6 22.83,55.1 22.59,55.35 22.4,55.62 22.69,55.47 22.95,55.27 24.3,56.62 25.65,57.97 25.44,58.23 25.31,58.43 25.3,58.52 25.58,58.31 25.77,58.13 25.89,58.12 26.75,58.78 28.22,59.8 28.93,60.25 28.77,60.58 28.65,60.82 28.67,60.89 28.92,60.63 29.07,60.36 30.12,60.89 31.86,61.69 32.55,61.96 32.37,62.54 32.39,62.65 32.6,62.32 32.71,62.02 33.41,62.25 36.26,62.99 36.39,63.06 36.38,63.28 36.32,63.6 36.39,63.69 36.46,63.61 36.52,63.37 36.58,63.09 36.68,63.05 38.75,63.3 39.7,63.4 40.05,66.09 40.03,66.19 39.83,66.22 38.16,66.1 35.82,65.79 33.49,65.25 31.2,64.48 28.99,63.5 27.15,62.49 25.45,61.37 23.85,60.1 22.28,58.64 20.81,57.06 19.54,55.45 18.42,53.75 17.41,51.91 16.35,49.47 15.54,46.96 15.01,44.41
N$46
  pour Top: 17.78,39.56 17.76,39.2 17.86,37.84 18.08,36.4 18.38,34.98 18.77,33.59 19.25,32.24 19.8,30.92 20.44,29.65 21.15,28.42 21.94,27.23 22.81,26.1 23.74,25.03 24.74,24.01 25.8,23.05 26.93,22.16 28.12,21.34 29.37,20.58 30.67,19.91 32.76,19.03 34.95,18.36 37.2,17.91 39.45,17.69 39.71,17.68 39.66,18 39.54,18.88 39.47,19.43 39.16,19.44 37.77,19.6 36.27,19.84 34.6,20.25 32.99,20.79 31.44,21.46 29.96,22.24 28.55,23.13 27.22,24.13 25.98,25.23 24.82,26.42 23.77,27.7 22.81,29.05 21.96,30.49 21.23,31.98 20.61,33.54 20.12,35.16 19.76,36.82 19.54,38.53 19.41,39.43 17.9,39.63
N$47
  pour Top: 14.94,40.02 14.71,40.06 14.76,38.97 14.91,37.15 15.21,35.32 15.66,33.49 16.24,31.69 16.96,29.92 17.81,28.2 18.78,26.55 19.87,24.98 20.74,23.89 21.66,22.85 22.63,21.87 23.65,20.94 24.71,20.07 25.82,19.26 28.15,17.82 29.36,17.2 30.61,16.64 31.89,16.14 33.2,15.72 34.52,15.37 35.87,15.08 37.24,14.87 38.62,14.73 39.84,14.67 40.02,14.7 40.05,14.78 40.05,14.78 40.01,15.23 39.86,16.24 39.81,16.82 39.69,17.46 39.58,17.53 39.38,17.54 36.92,17.78 36.56,17.83 36.52,17.51 36.38,17.2 36.33,17.26 36.35,17.49 36.41,17.83 36.02,17.95 33.4,18.63 32.72,18.81 32.57,18.5 32.44,18.24 32.39,18.23 32.37,18.33 32.47,18.68 32.53,18.89 32.4,18.98 30.05,20.04 29.08,20.54 28.9,20.24 28.66,19.98 28.77,20.32 28.95,20.62 28.65,20.8 26.43,22.34 25.82,22.82 25.6,22.57 25.3,22.35 25.29,22.44 25.44,22.63 25.63,22.94 24.85,23.69 23.86,24.65 23.3,25.28 22.97,25.64 22.7,25.42 22.37,25.26 22.41,25.35 22.59,25.53 22.76,25.68 22.79,25.81 22.23,26.58 21.29,27.92 20.71,28.88 20.4,28.76 20.09,28.6 20.02,28.65 20.28,28.86 20.55,29.03 20.03,30.1 19.23,31.83 18.92,32.49 18.59,32.39 18.36,32.33 18.3,32.38 18.58,32.55 18.85,32.71 18.64,33.45 17.92,36.24 17.85,36.36 17.58,36.32 17.24,36.3 17.2,36.33 17.27,36.4 17.63,36.5 17.84,36.56 17.87,36.66 17.58,39.09 17.54,39.69 17.18,39.73 16.64,39.81 15.36,39.97
N$48
  pour Top: 37.5,45.77 27.91,53.2 27.94,53.15 28.17,52.92 29.1,51.96 32.4,48.63 37.24,43.81 37.4,44.78
N$49
  pour Top: 40.61,55.36 40.6,44.09 40.87,44.09 41.63,43.93 42.43,43.55 42.89,43.2 43.02,43.14 43.28,43.37 43.28,43.37 43.51,43.61 42.08,55.05 40.63,66.56
N$50
  pour Top: 45.69,43.43 43.82,43.67 48.67,48.55 52.35,52.18 53.03,52.82 53.13,52.89 53.07,52.8 49.21,47.83
N$51
  pour Top: 43.36,38.15 43.15,37.88 43.36,37.66 43.68,37.43 55.18,38.85 55.18,38.85 66.62,40.32 55.43,40.38 44.19,40.39 44.1,39.88 43.83,38.98
N$52
  pour Top: 43.56,36.1 43.44,35.15 44.13,34.61 53.36,27.42 48.56,32.25 43.7,37.06
N$53
  pour Top: 38.9,25.61 37.44,37.26 37.69,37.51 37.94,37.76 38.25,37.53 39.1,37.04 40.07,36.78 40.39,36.73 40.39,25.35 40.39,25.35 40.38,13.97
N$54
  pour Top: 31.37,32.58 27.48,27.55 28.86,28.91 32.28,32.32 37.14,37.21 36.31,37.33 35.34,37.47 35.13,37.31 34.54,36.63
N$55
  pour Top: 25.78,42.03 14.09,40.56 17.34,40.55 25.37,40.55 36.79,40.55 36.84,40.9 37.1,41.87 37.6,42.74 37.81,43 37.57,43.24 37.33,43.48
N$56
  pour Top: 20.33,38.1 19.93,37.71 21.73,36.99 22.16,36.82 21.65,36.29 20.74,35.45 20.48,35.15 20.5,35.03 22.57,34.52 22.83,34.44 22.45,33.98 21.61,32.96 21.38,32.61 21.34,32.46 23.26,32.25 23.79,32.2 23.58,31.9 22.49,30.07 23.73,30.05 24.71,30.07 24.94,30.01 24.45,28.91 24,27.83 24.31,27.8 25.54,28.01 26.46,28.14 26.34,27.71 25.78,25.8 25.88,25.77 26.18,25.82 27.46,26.22 28.17,26.42 28.05,25.62 27.86,24.38 27.82,23.92 28.36,24.15 29.51,24.67 30.13,24.93 30.08,23.73 30.06,22.49 30.47,22.64 31.46,23.25 32.22,23.71 32.33,22.91 32.42,21.77 32.53,21.27 33,21.58 34.03,22.42 34.31,22.67 34.46,22.74 34.54,22.63 34.6,22.34 35.12,20.35 35.98,21.24 36.84,22.13 37.04,21.67 37.39,20.69 37.66,20.03 37.77,19.87 38.18,20.33 38.18,20.33 38.85,21.3 39.18,21.8 38.38,28.26 37.54,34.84 36.36,34.03 32.08,30.74 26.62,26.55 26.62,26.68 30.82,32.12 34.98,37.47 34.72,37.52 28.13,38.36 21.8,39.15 21.37,38.86
N$57
  pour Top: 20.47,43.43 19.88,43.14 21,42.29 21.86,41.75 28.42,42.55 28.42,42.55 34.92,43.4 30.79,48.81 26.61,54.25 26.67,54.31 32.1,50.13 37.52,46 38.37,52.57 39.18,59.1 38.92,59.5 37.78,61.03 37.52,60.52 37.1,59.39 36.85,58.71 36.61,58.95 35.11,60.48 34.92,59.92 34.64,58.77 34.48,58.15 34.07,58.43 32.52,59.63 32.3,57.63 32.25,57.17 31.89,57.35 30.87,58.01 30.1,58.43 30.05,58.18 30.07,57.31 30.15,56.07 30.15,55.98 30.03,55.99 29.04,56.42 27.98,56.88 27.82,56.93 27.86,56.5 28.05,55.28 28.17,54.48 27.73,54.59 25.85,55.13 25.8,55.08 25.83,54.88 26.16,53.73 26.43,52.74 25.43,52.89 24.15,53.1 24.02,53.07 24.03,52.96 24.52,51.8 24.95,50.79 23.74,50.84 22.51,50.86 22.64,50.49 23.28,49.46 23.59,48.97 23.69,48.72 23.56,48.63 23.19,48.61 21.29,48.4 22.63,46.68 22.77,46.48 22.75,46.39 22.08,46.25 20.95,45.99 20.43,45.81 21.93,44.34 22.2,44.06 21.6,43.85
N$58
  pour Top: 41.91,59.32 41.77,59.07 42.59,52.53 43.43,45.97 48.87,50.15 54.34,54.31 50.18,48.83 45.97,43.4 58.92,41.76 59.25,41.85 59.85,42.22 59.85,42.22 60.82,42.92 61.12,43.16 60.76,43.32 59.59,43.76 58.78,44.09 59.67,44.93 60.56,45.8 58.57,46.32 58.28,46.38 58.17,46.45 58.25,46.6 58.49,46.89 59.34,47.92 59.64,48.39 58.88,48.52 57.79,48.61 57.42,48.63 57.28,48.72 57.34,48.94 57.6,49.34 58.2,50.31 58.44,50.81 58.21,50.87 57.32,50.85 56.08,50.76 55.99,50.76 55.99,50.82 56.51,51.98 56.99,53.04 56.79,53.06 54.69,52.75 54.47,52.72 54.7,53.43 55.1,54.75 55.15,55.04 55.11,55.13 53.2,54.58 52.77,54.46 52.87,55.14 53.05,56.16 53.13,56.74 53.14,56.9 52.99,56.89 51.84,56.4 50.85,55.96 50.87,57.19 50.84,58.43 49.02,57.34 48.71,57.13 48.67,57.72 48.45,59.58 48.3,59.54 47.95,59.3 46.92,58.45 46.47,58.09 46.31,58.77 46.02,59.99 45.87,60.56 45.66,60.37 44.81,59.47 44.13,58.75 43.79,59.56 43.36,60.7 43.23,60.95 43.14,61
N$59
  pour Top: 42.59,28.35 41.76,21.79 42.05,21.36 42.8,20.31 43.22,19.86 43.54,20.63 43.54,20.63 43.94,21.74 44.12,22.13 44.39,21.88 45.34,20.87 45.89,20.44 46.4,22.57 46.45,22.83 46.73,22.58 48.42,21.24 48.67,23.22 48.74,23.71 49.43,23.28 50.51,22.62 50.91,22.39 50.87,23.67 50.86,24.95 51.31,24.74 53.05,23.99 53.11,24.04 53.12,24.26 52.91,25.53 52.77,26.43 53.38,26.25 55.17,25.75 54.6,27.77 54.49,28.16 55.02,28.08 56.92,27.8 56.83,28.17 56.37,29.19 55.97,30.07 57.25,30.05 58.53,30 58.3,30.41 57.63,31.49 57.22,32.18 59.59,32.43 59.67,32.49 58.34,34.18 58.09,34.47 58.35,34.51 60.48,35.03 60.33,35.28 59.67,35.95 58.78,36.84 59.4,37.05 60.59,37.51 61.07,37.78 59.42,38.97 59.12,39.15 52.56,38.33 45.98,37.49 50.18,32.06 54.35,26.58 54.34,26.55 54.29,26.56 53.75,26.95 48.7,30.87 43.43,34.93
N$60
  pour Top: 297 corners
N$88
  Bottom 0.152: D7.2-DIN 75.24,27.41 D6.4-DOUT
N$89
  Bottom 0.152: D7.4-DOUT 50.79,5.06 D8.2-DIN
N$90
  Bottom 0.152: D5.4-DOUT 65.08,50.34 D6.2-DIN
N$91
  Bottom 0.152: U$1.5 26.6,17.28 | 26.6,17.28 27.24,17.28 | U1.1 30,26.19 30.15,26.19 31.38,24.97 31.38,22.69 29.14,20.46 29.14,19.19 30.41,17.92 32.95,17.92 32.95,17.8 33.07,17.68 33.07,16.89 32.95,16.77 32.95,16.65 27.24,16.65 26.6,17.28
N$92
  Bottom 0.152: U$1.4 29.78,17.28 28.84,18.22 28.84,23.57 29.8,24.53 29.8,24.68 U1.4
VCC1  (2 unrouted)
  Bottom 0.152: U$1.1 31.68,21.15 | 31.68,21.15 31.68,26.81 28.75,26.81 28.49,26.55 28.49,26.4 U1.10 U1.9 | U$5.+$2 50.16,21.15 31.68,21.15
VDD2
  Bottom 0.152: D8.3-VDD 54.7,10.46 59.62,15.38 59.62,17.19 D7.3-VDD 62,24.11 71.94,34.05 D6.3-VDD 71.21,38.08 69.78,39.51 69.78,43.32 63.43,49.67 63.43,58.02 D5.3-VDD 61.05,59.67 49.84,70.88 D4.3-VDD 43.27,70.15 41.84,68.72 23.01,68.72 D3.3-VDD 23.9,66.34 24.06,66.18 24.06,58.34 D2.3-VDD 11.2,43.48 18.98,35.7 18.98,21 D1.3-VDD 20.16,19.82 U$1.7